# Altium schematic sheet Filter.SchDoc
size A4
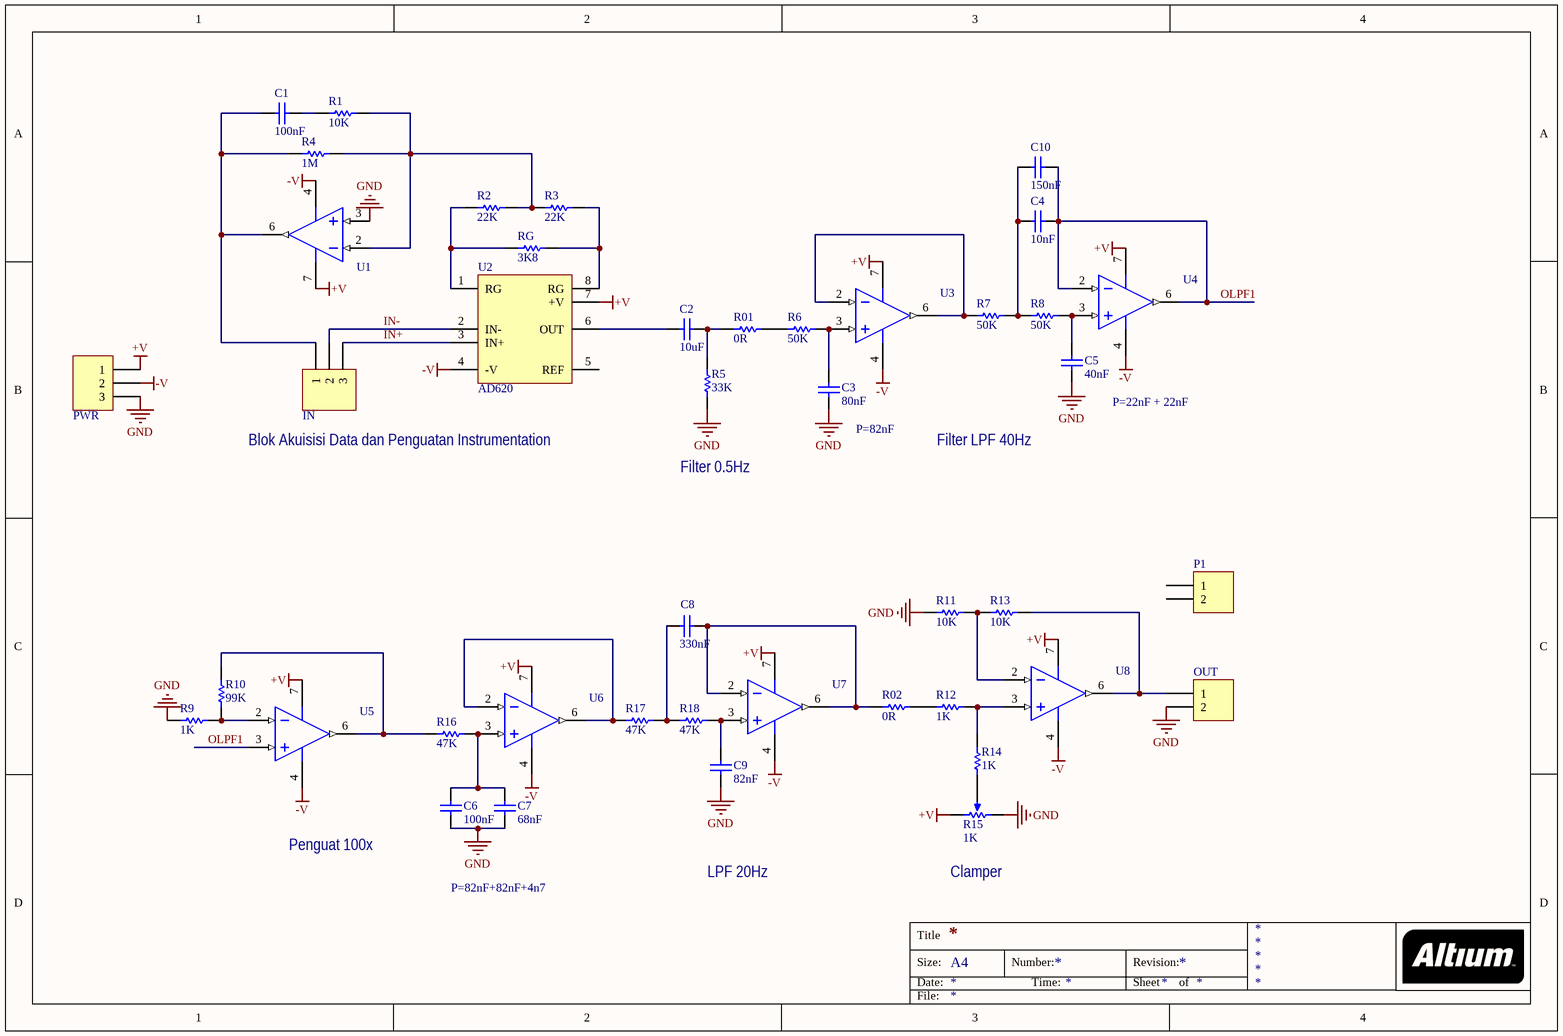
[diagram p0: Filter.SchDoc]

## Parts
C1  value 100nF  [CAPC2013M]  (hidden comment: Cap)
C2  value 10uF  [CAPC2013M]  (hidden comment: Cap)
C3  value 80nF  [CAPC2013M]  (hidden comment: Cap)
C4  value 10nF  [CAPC2013M]  (hidden comment: Cap)
C5  value 40nF  [CAPC2013M]  (hidden comment: Cap)
C6  value 100nF  [CAPC2013M]  (hidden comment: Cap)
C7  value 68nF  [CAPC2013M]  (hidden comment: Cap)
C8  value 330nF  [CAPC2013M]  (hidden comment: Cap)
C9  value 82nF  [CAPC2013M]  (hidden comment: Cap)
C10  value 150nF  [CAPC2013M]  (hidden comment: Cap)
IN  Header 3  [HDR1X3]  (value not drawn)
OUT  Header 2  [HDR1X2]  (value not drawn)
P1  Header 2  [HDR1X2]  (value not drawn)
PWR  Header 3  [HDR1X3]  (value not drawn)
R1  value 10K  [RESC2013M]  (hidden comment: Res1)
R01  value 0R  [RESC2013M]  (hidden comment: Res)
R2  value 22K  [RESC2013M]  (hidden comment: Res1)
R02  value 0R  [RESC2013M]  (hidden comment: Res)
R3  value 22K  [RESC2013M]  (hidden comment: Res1)
R4  value 1M  [RESC3216N]  (hidden comment: Res)
R5  value 33K  [RESC2013M]  (hidden comment: Res1)
R6  value 50K  [RESC2013M]  (hidden comment: Res1)
R7  value 50K  [RESC2013M]  (hidden comment: Res1)
R8  value 50K  [RESC2013M]  (hidden comment: Res1)
R9  value 1K  [RESC2013M]  (hidden comment: Res1)
R10  value 99K  [RESC2013M]  (hidden comment: Res1)
R11  value 10K  [RESC2013M]  (hidden comment: Res1)
R12  value 1K  [RESC2013M]  (hidden comment: Res1)
R13  value 10K  [RESC2013M]  (hidden comment: Res1)
R14  value 1K  [RESC2013M]  (hidden comment: Res1)
R15  value 1K  [VR6]  (hidden comment: RPot)
R16  value 47K  [RESC2013M]  (hidden comment: Res1)
R17  value 47K  [RESC2013M]  (hidden comment: Res1)
R18  value 47K  [RESC2013M]  (hidden comment: Res1)
RG  value 3K8  [RESC2013M]  (hidden comment: Res1)
U1  OP07  [SOIC127P600X195-8M]  (value not drawn)
U2  AD620  [SOIC127P600X195-8M]
U3  OP07  [SOIC127P600X195-8M]  (value not drawn)
U4  OP07  [SOIC127P600X195-8M]  (value not drawn)
U5  OP07  [SOIC127P600X195-8M]  (value not drawn)
U6  OP07  [SOIC127P600X195-8M]  (value not drawn)
U7  OP07  [SOIC127P600X195-8M]  (value not drawn)
U8  OP07  [SOIC127P600X195-8M]  (value not drawn)

## Nets
+V: PWR.1 R15.3(BOT) U1.7(V+) U2.7(+V) U3.7(V+) U4.7(V+) U5.7(V+) U6.7(V+) U7.7(V+) U8.7(V+)
-V: PWR.2 U1.4(V-) U2.4(-V) U3.4(V-) U4.4(V-) U5.4(V-) U6.4(V-) U7.4(V-) U8.4(V-)
GND: C3.1 C5.1 C6.1 C7.1 C9.1 OUT.2 PWR.3 R5.2 R9.2 R11.2 R15.1(TOP) U1.3(IN+)
IN+: IN.3 U2.3(IN+)
IN-: IN.2 U2.2(IN-)
OLPF1: C4.2 C10.2 U4.2(IN-) U4.6(Out) U5.3(IN+)
NetC1_1: C1.1 IN.1 R4.1 U1.6(Out)
NetC1_2: C1.2 R1.1
NetC2_1: C2.1 U2.6(OUT)
NetC2_2: C2.2 R01.1 R5.1
NetC3_2: C3.2 R6.2 U3.3(IN+)
NetC4_1: C4.1 C10.1 R7.2 R8.1
NetC5_2: C5.2 R8.2 U4.3(IN+)
NetC6_2: C6.2 C7.2 R16.2 U6.3(IN+)
NetC8_1: C8.1 R17.2 R18.1
NetC8_2: C8.2 R02.1 U7.2(IN-) U7.6(Out)
NetC9_2: C9.2 R18.2 U7.3(IN+)
NetOUT_1: OUT.1 R13.2 U8.6(Out)
NetR1_2: R1.2 R2.2 R3.1 R4.2 U1.2(IN-)
NetR01_2: R01.2 R6.1
NetR2_1: R2.1 RG.1 U2.1(RG)
NetR02_2: R02.2 R12.1
NetR3_2: R3.2 RG.2 U2.8(RG)
NetR7_1: R7.1 U3.2(IN-) U3.6(Out)
NetR9_1: R9.1 R10.1 U5.2(IN-)
NetR10_2: R10.2 R16.1 U5.6(Out)
NetR11_1: R11.1 R13.1 U8.2(IN-)
NetR12_2: R12.2 R14.2 U8.3(IN+)
NetR14_1: R14.1 R15.2(TAP)
NetR17_1: R17.1 U6.2(IN-) U6.6(Out)

Not connected (* = marked no-connect by the designer): P1 1 2; U2 5(REF)

## Notes on the sheet
- Blok Akuisisi Data dan Penguatan Instrumentation
- (near C3) P=82nF
- Filter LPF 40Hz
- P=22nF + 22nF
- Filter 0.5Hz
- Penguat 100x
- P=82nF+82nF+4n7
- LPF 20Hz
- (near R15) Clamper
- Title
- Size:
- Date:
- A4
- Number:
- Time:
- Revision:
- Sheet
- of
- File:

## Library data of the parts
C1 C3-C10 = Cap: Capacitor; Published: 8-Jun-2000; LatestRevisionDate: 17-Jul-2002; LatestRevisionNote: Re-released for DXP Platform.; PackageReference: RAD-0.3; Publisher: Altium Limited
C2 = Cap SMD: Capacitor
IN PWR = Header 3: Header, 3-Pin; LatestRevisionDate: 17-Jul-2002; LatestRevisionNote: Re-released for DXP Platform.; Publisher: Altium Limited
OUT P1 = Header 2: Header, 2-Pin; LatestRevisionDate: 17-Jul-2002; LatestRevisionNote: Re-released for DXP Platform.; Publisher: Altium Limited
R1-R3 R5-R14 R16-R18 RG = Res1: Resistor; Published: 8-Jun-2000; LatestRevisionDate: 17-Jul-2002; LatestRevisionNote: Re-released for DXP Platform.; PackageReference: AXIAL-0.3; Publisher: Altium Limited
R01 R02 R4 = Res SMD: Resistor
R15 = RPot: Potentiometer